# Altium project APD_part.PrjPcb
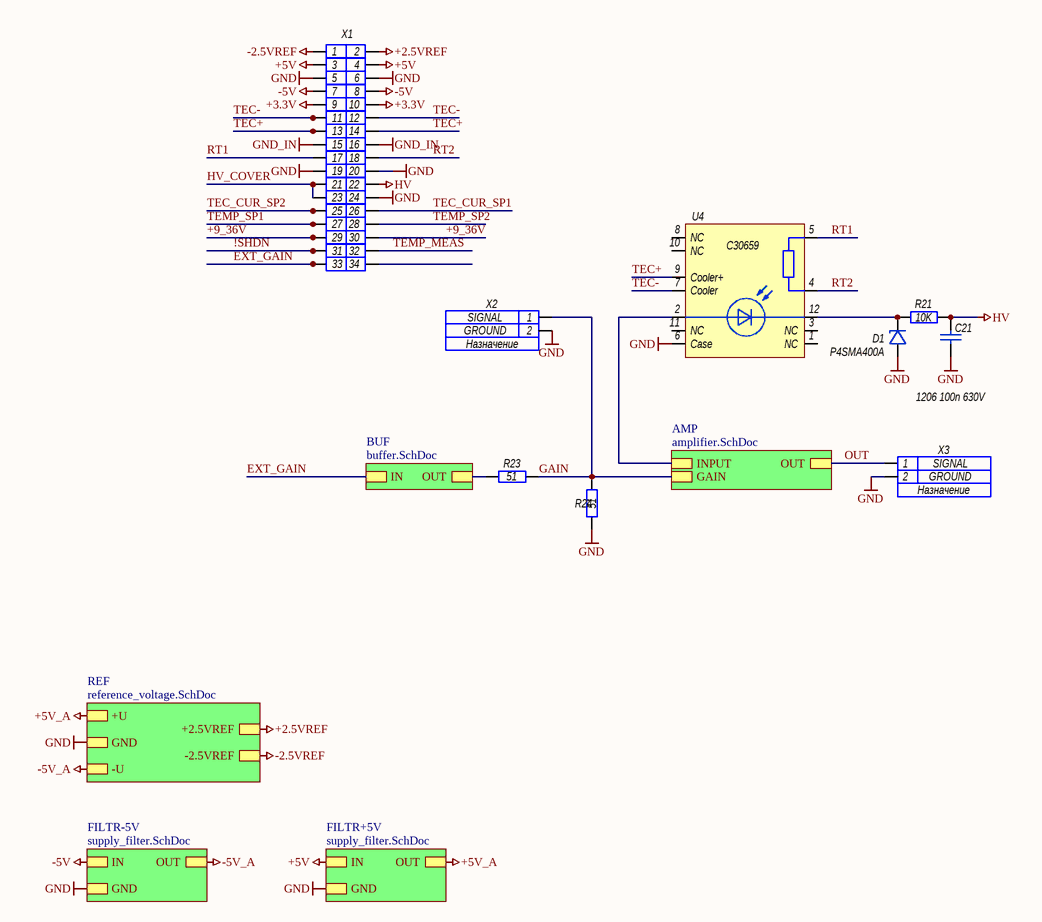
[diagram p0: main.SchDoc]
5 sheets, 76 parts. Net scope: hierarchical (ports join the sheet entries above them; power ports are global).
Board file: APD_part.PcbDoc
Sheets:
  main.SchDoc
    REF = reference_voltage.SchDoc
    FILTR+5V = supply_filter.SchDoc
    FILTR-5V = supply_filter.SchDoc
    AMP = amplifier.SchDoc
    BUF = buffer.SchDoc

## Sheet main.SchDoc
size A4; SheetNumber: 1; SheetTotal: 6

### Parts
C21  1206 100n 630V  [CAP_2220]
D1  P4SMA400A  [SOD-123]
R21  10K  [RES_0805]
R23  51  [RES_0603]
R24  51  [RES_0603]
U4  C30659  [C30659]
X1  ?  [BH-34]  (value not drawn)
X2  Net1: SIGNAL  Net2: GROUND  Name: Назначение  [SMA_V]  (hidden comment: Model)
X3  Net1: SIGNAL  Net2: GROUND  Name: Назначение  [SMA_V]  (hidden comment: Model)

### Sub-sheets
AMP = amplifier.SchDoc: GAIN, INPUT, OUT
BUF = buffer.SchDoc: IN, OUT
FILTR+5V = supply_filter.SchDoc: IN, OUT, GND
FILTR-5V = supply_filter.SchDoc: IN, OUT, GND
REF = reference_voltage.SchDoc: GND, -U, -2.5VREF, +2.5VREF, +U

### Nets
+2.5VREF: X1.2 ; sheet REF/+2.5VREF
+3.3V: X1.9 X1.10
+5V: X1.3 X1.4 ; sheet FILTR+5V/IN
+5V_A: sheet REF/+U, sheet FILTR+5V/OUT
-2.5VREF: X1.1 ; sheet REF/-2.5VREF
-5V: X1.7 X1.8 ; sheet FILTR-5V/IN
-5V_A: sheet REF/-U, sheet FILTR-5V/OUT
GND: C21.2 D1.1 R24.1 U4.6(Case) X1.5 X1.6 X1.19 X1.20 X1.24 X2.G(2) X3.G(2) ; sheet REF/GND, sheet FILTR+5V/GND, sheet FILTR-5V/GND
GND_IN: X1.15 X1.16
HV: C21.1 R21.2 X1.22
!SHDN: X1.31
+9_36V: X1.29 X1.30
EXT_GAIN: X1.33 ; sheet BUF/IN
GAIN: R23.2 R24.2 X2.S(1) ; sheet AMP/GAIN
HV_COVER: X1.21 X1.23
OUT: X3.S(1) ; sheet AMP/OUT
RT1: U4.5 X1.17
RT2: U4.4 X1.18
TEC+: U4.9(Cooler+) X1.13 X1.14
TEC-: U4.7(Cooler) X1.11 X1.12
TEC_CUR_SP1: X1.26
TEC_CUR_SP2: X1.25
TEMP_MEAS: X1.32
TEMP_SP1: X1.27
TEMP_SP2: X1.28
NetC4_1: U4.2 ; sheet AMP/INPUT
NetD1_2: D1.2 R21.1 U4.12
NetR23_1: R23.1 ; sheet BUF/OUT

Not connected (* = marked no-connect by the designer): U4 1(NC) 3(NC) 8(NC) 10(NC) 11(NC); X1 34

### Library data of the parts
C21 = Capacitor: Конденсатор
D1 = SMFxxA: Диод защитный; ValueBOM: -; ValueSCH: -; MarkPCB: -; HelpURL: C:\Datasheets\SMF.pdf
R21 = Resisitor: Резистор; ValueBOM: 0805 10k 0.125; MarkPCB: 103; ValueSCH: 10k
R23 R24 = Resisitor: Резистор; ValueBOM: 0805 10k 0.125; ValueSCH: 10k; MarkPCB: 103
U4 = C30659: Модуль с ЛФД; ValueBOM: C30659; ValueSCH: C30659; MarkPCB: C30659; HelpURL: C:\Datasheets\C30659.pdf
X1 = Connector 17x2: ValueSCH: Model
X2 X3 = Connector 2: ValueSCH: Model

## Sheet reference_voltage.SchDoc
size A3; SheetNumber: 3; SheetTotal: 5
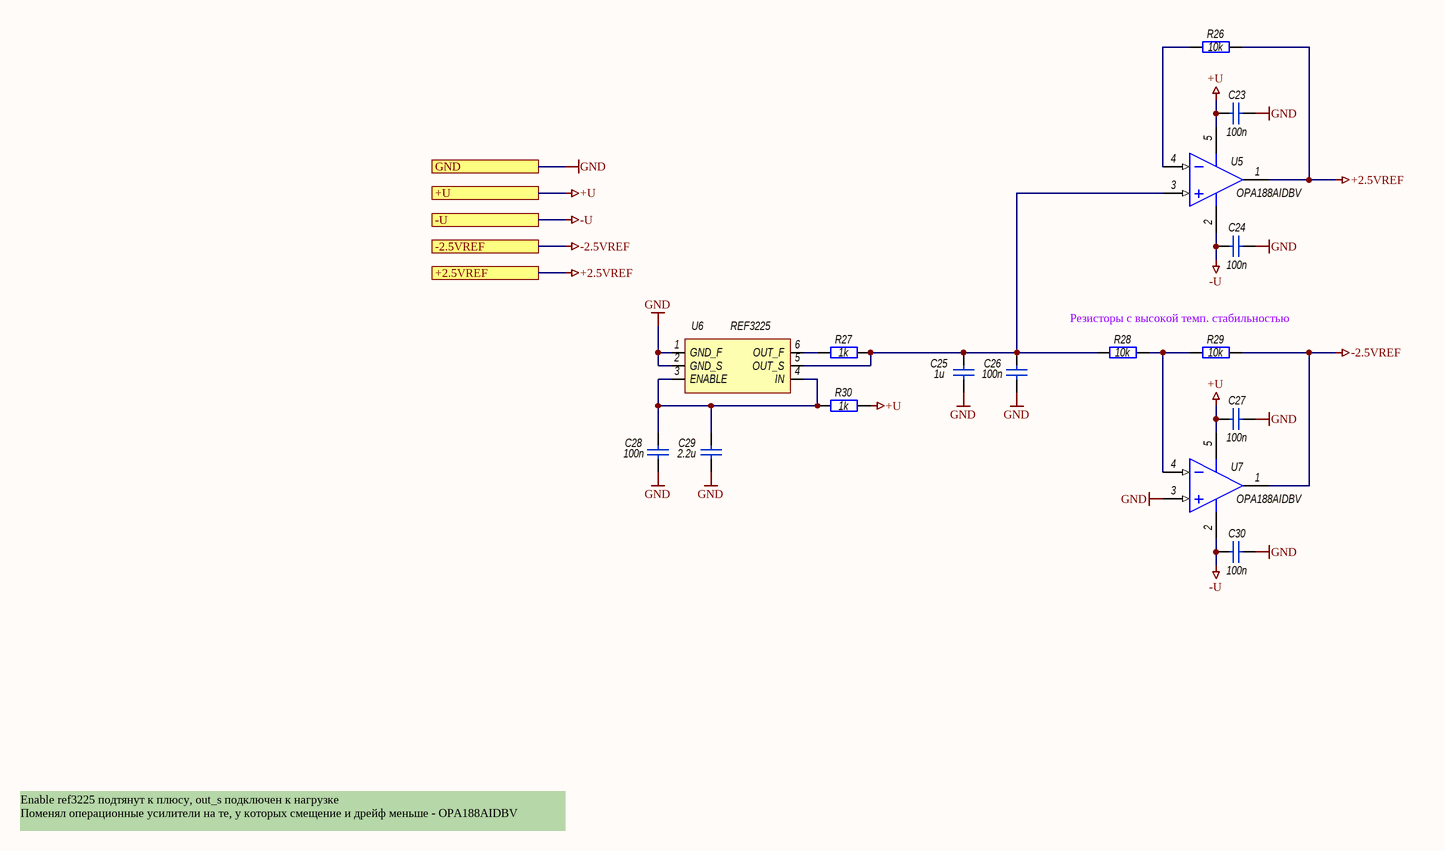
[diagram p1: reference_voltage.SchDoc]

### Parts
C23  100n  [CAP_0603]
C24  100n  [CAP_0603]
C25  1u  [CAP_0603]
C26  100n  [CAP_0603]
C27  100n  [CAP_0603]
C28  100n  [CAP_0603]
C29  2.2u  [CAP_0603]
C30  100n  [CAP_0603]
R26  10k  [RES_0603]
R27  1k  [RES_0603]
R28  10k  [RES_0603]
R29  10k  [RES_0603]
R30  1k  [RES_0603]
U5  OPA188AIDBV  [sot235]
U6  REF3225  [SOT236]
U7  OPA188AIDBV  [sot235]

### Ports
+2.5VREF, +U, -2.5VREF, -U, GND

### Nets
+2.5VREF: R26.2 U5.1(OUT) ; port +2.5VREF
+U: C23.1 C27.1 R30.2 U5.5(V+) U7.5(V+) ; port +U  [project net +5V_A]
-2.5VREF: R29.2 U7.1(OUT) ; port -2.5VREF
-U: C24.1 C30.1 U5.2(V-) U7.2(V-) ; port -U  [project net -5V_A]
GND: C23.2 C24.2 C25.1 C26.1 C27.2 C28.1 C29.1 C30.2 U6.1(GND_F) U6.2(GND_S) U7.3(IN+) ; port GND
NetC25_2: C25.2 C26.2 R27.2 R28.1 U5.3(IN+) U6.5(OUT_S)
NetC28_2: C28.2 C29.2 R30.1 U6.3(ENABLE) U6.4(IN)
NetR26_1: R26.1 U5.4(IN-)
NetR27_1: R27.1 U6.6(OUT_F)
NetR28_2: R28.2 R29.1 U7.4(IN-)

### Notes on the sheet
- Резисторы с высокой темп. стабильностью
- Enable ref3225 подтянут к плюсу, out_s подключен к нагрузке
  Поменял операционные усилители на те, у которых смещение и дрейф меньше - OPA188AIDBV

### Library data of the parts
C23-C30 = Capacitor: Конденсатор
R26 R28 R29 = Resisitor: as R21 on sheet main; ValueSCH: 10k
R27 R30 = Resisitor: Резистор
U5 U7 = OPAMP SOT235: Операционный усилитель
U6 = REF32xx: Источник опорного напряжения; ValueBOM: REF32xx; ValueSCH: REF32xx; HelpURL: C:\Datasheets\REF32xx.pdf

## Sheet supply_filter.SchDoc
size A4; SheetNumber: 4; SheetTotal: 5
Used 2 times, as channels FILTR+5V, FILTR-5V. Parts and nets are listed once, with the designators drawn on the sheet.
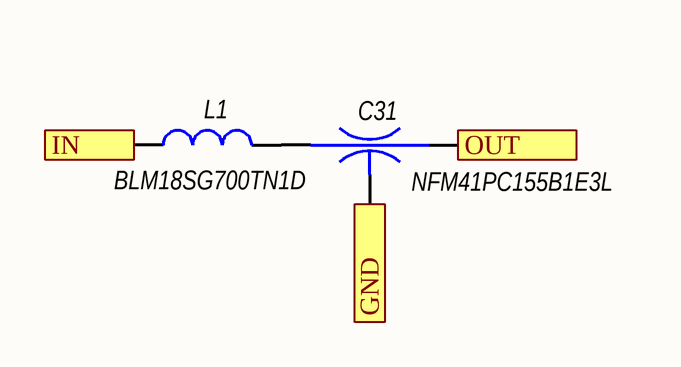
[diagram p2: supply_filter.SchDoc]

### Parts
C31  NFM41PC155B1E3L  [FIL_NFM41PC155B1E3L]
L1  BLM18SG700TN1D  [RES_0603]

### Ports
GND, IN, OUT

### Nets
GND: C31.2 ; port GND
IN: L1.2 ; port IN
OUT: C31.3 ; port OUT
NetC31_1: C31.1 L1.1

### Channels
FILTR+5V: designators end in _FILTR+5V; ports GND=GND IN=+5V OUT=+5V_A
FILTR-5V: designators end in _FILTR-5V; ports GND=GND IN=-5V OUT=-5V_A

### Library data of the parts
C31 = Capacity_filtr: Емкостной фильтр проходной
L1 = FERRITE_BEAD: Дроссель ЭМП; ValueBOM: SDR0403-101k; ValueSCH: 100u; MarkPCB: 101; HelpURL: C:\Datasheets\SRD0403.pdf

## Sheet amplifier.SchDoc
size A4; SheetNumber: 2; SheetTotal: 5
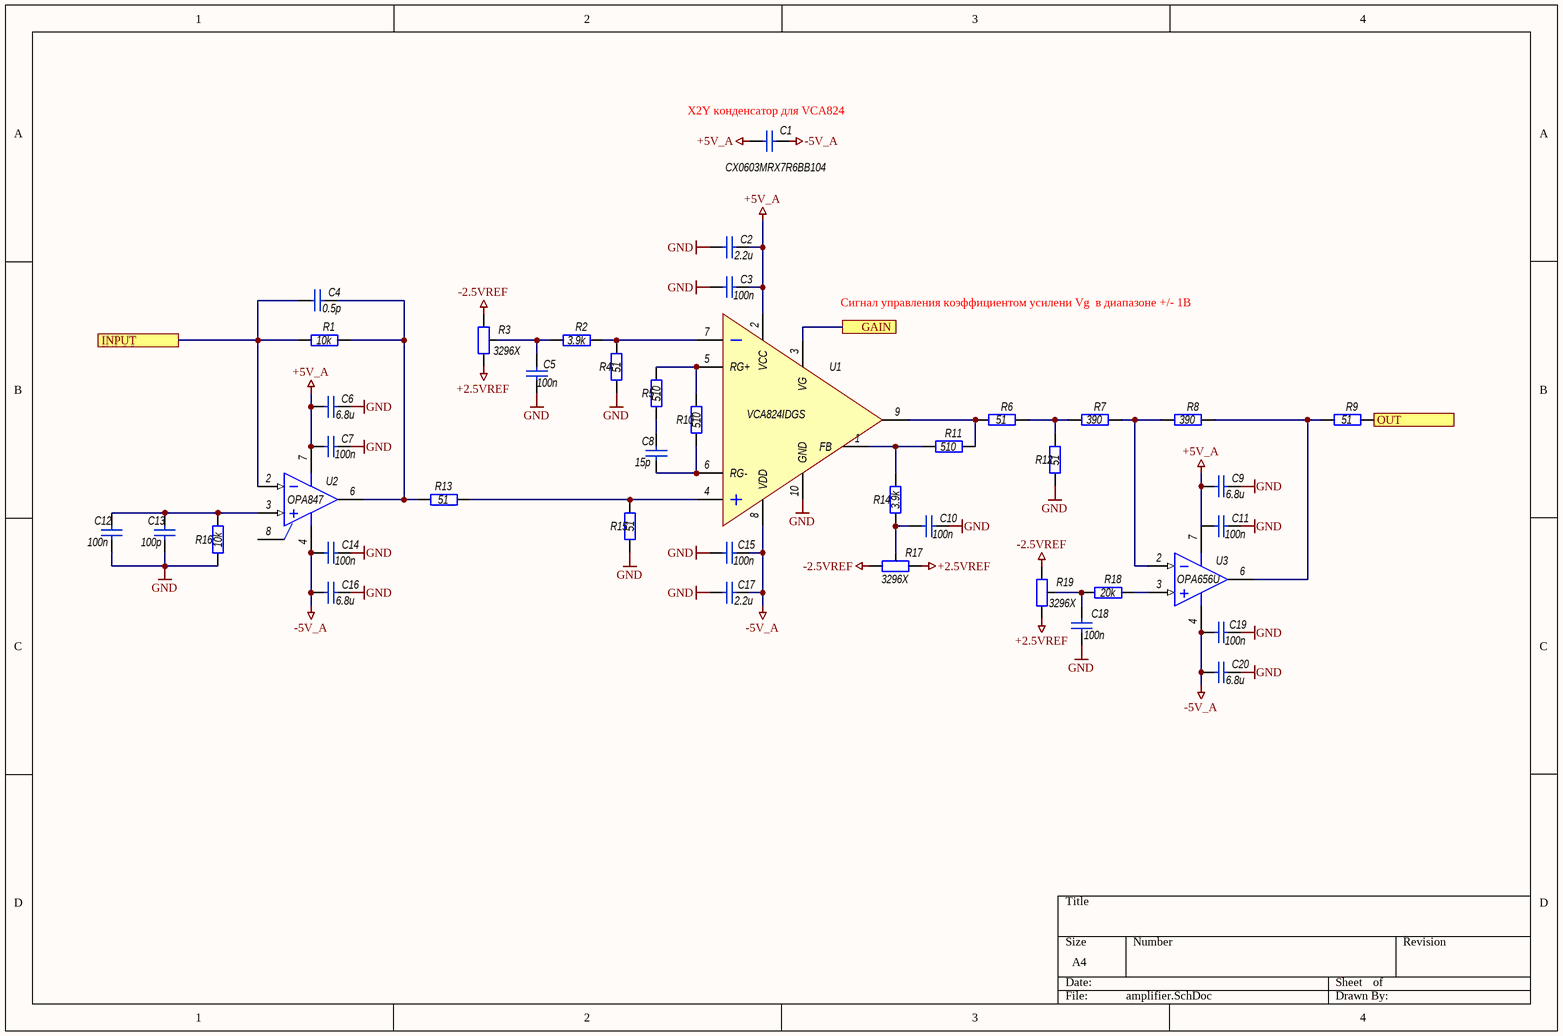
[diagram p3: amplifier.SchDoc]

### Parts
C1  CX0603MRX7R6BB104  [CAP_0603]
C2  2.2u  [CAP_0805]
C3  100n  [CAP_0603]
C4  0.5p  [CAP_0603]
C5  100n  [CAP_0603]
C6  6.8u  [CAP_0805]
C7  100n  [CAP_0603]
C8  15p  [CAP_0603]
C9  6.8u  [CAP_0805]
C10  100n  [CAP_0603]
C11  100n  [CAP_0603]
C12  100n  [CAP_0603]
C13  100p  [CAP_0603]
C14  100n  [CAP_0603]
C15  100n  [CAP_0603]
C16  6.8u  [CAP_0805]
C17  2.2u  [CAP_0805]
C18  100n  [CAP_0603]
C19  100n  [CAP_0603]
C20  6.8u  [CAP_0805]
R1  10k  [RES_0603]
R2  3.9k  [RES_0603]
R3  3296X  [3296X]
R4  51  [RES_0603]
R5  510  [RES_0603]
R6  51  [RES_0805]
R7  390  [RES_0603]
R8  390  [RES_0603]
R9  51  [RES_0805]
R10  510  [RES_0603]
R11  510  [RES_0603]
R12  51  [RES_0805]
R13  51  [RES_0805]
R14  3.9k  [RES_0603]
R15  51  [RES_0805]
R16  10k  [RES_0603]
R17  3296X  [3296X]
R18  20k  [RES_0603]
R19  3296X  [3296X]
U1  VCA824IDGS  [VSSOP10]
U2  OPA847  [SO8-150]
U3  OPA656U  [SO8-150]

### Ports
GAIN, INPUT, OUT

### Nets
+2.5VREF: R3.1 R17.1 R19.1
+5V_A: C1.1 C2.2 C3.2 C6.1 C7.1 C9.1 C11.1 U1.2(VCC) U2.7(V+) U3.7(V+)
-2.5VREF: R3.3 R17.3 R19.3
-5V_A: C1.2 C14.1 C15.2 C16.1 C17.2 C19.1 C20.1 U1.8(VDD) U2.4(V-) U3.4(V-)
GND: C2.1 C3.1 C5.2 C6.2 C7.2 C9.2 C10.2 C11.2 C12.1 C13.1 C14.2 C15.1 C16.2 C17.1 C18.2 C19.2 C20.2 R4.1 R12.1 R15.1 R16.1 U1.10(GND)
GAIN: U1.3(VG) ; port GAIN
OUT: R9.2 ; port OUT
NetC4_1: C4.1 R1.1 U2.2(IN-) ; port INPUT
NetC4_2: C4.2 R1.2 R13.1 U2.6(OUT)
NetC5_1: C5.1 R2.1 R3.2
NetC8_1: C8.1 R10.1 U1.6(RG-)
NetC8_2: C8.2 R5.1
NetC10_1: C10.1 R14.1 R17.2
NetC12_2: C12.2 C13.2 R16.2 U2.3(IN+)
NetC18_1: C18.1 R18.1 R19.2
NetR2_2: R2.2 R4.2 U1.7(RG)
NetR5_2: R5.2 R10.2 U1.5(RG+)
NetR6_1: R6.1 R11.2 U1.9(FB)
NetR6_2: R6.2 R7.1 R12.2
NetR7_2: R7.2 R8.1 U3.2(IN-)
NetR8_2: R8.2 R9.1 U3.6(OUT)
NetR11_1: R11.1 R14.2 U1.1(FB)
NetR13_2: R13.2 R15.2 U1.4(RG)
NetR18_2: R18.2 U3.3(IN+)

Not connected (* = marked no-connect by the designer): U2 8(RG)

### Notes on the sheet
- (near C1) X2Y конденсатор для VCA824
- (near U1) Сигнал управления коэффициентом усилени Vg  в диапазоне +/- 1В

### Library data of the parts
C1-C20 = Capacitor: Конденсатор
R1 R16 = Resisitor: as R21 on sheet main; ValueSCH: 10k
R2 R4-R15 R18 = Resisitor: as R23 on sheet main
R3 R17 R19 = 3296X: Резистор подстроечный; ValueBOM: 3296X; ValueSCH: 3296X; HelpURL: C:\Datasheets\.pdf
U1 = VCA824 (VSOP10)
U2 = OPA847: Операционный усилитель; ValueBOM: OPA847; ValueSCH: OPA847; MarkPCB: OPA847; HelpURL: C:\Datasheets\OPA847.pdf
U3 = OPA657: Операционный усилитель; ValueBOM: OPA657; ValueSCH: OPA657; MarkPCB: OPA657; HelpURL: C:\Datasheets\OPA657.pdf

## Sheet buffer.SchDoc
size A4; SheetNumber: 5; SheetTotal: 5
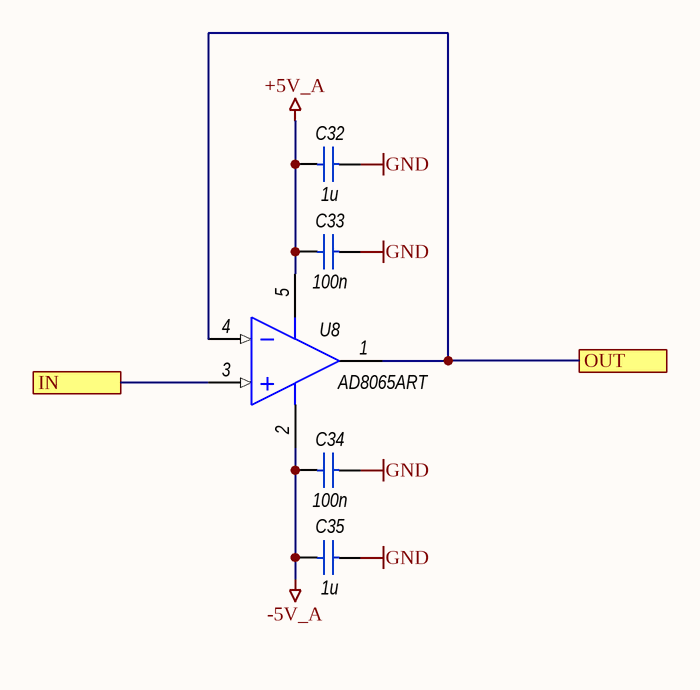
[diagram p4: buffer.SchDoc]

### Parts
C32  1u  [CAP_0603]
C33  100n  [CAP_0603]
C34  100n  [CAP_0603]
C35  1u  [CAP_0603]
U8  AD8065ART  [sot235]

### Ports
IN, OUT

### Nets
+5V_A: C32.1 C33.1 U8.5(V+)
-5V_A: C34.1 C35.1 U8.2(V-)
GND: C32.2 C33.2 C34.2 C35.2
EXT_GAIN: U8.3(IN+) ; port IN
NetR23_1: U8.1(OUT) U8.4(IN-) ; port OUT

### Library data of the parts
C32-C35 = Capacitor: Конденсатор
U8 = OPAMP SOT235: Операционный усилитель

## Nets that join several sheets
+2.5VREF: main (X1.2), reference_voltage (R26.2 U5.1), amplifier (R3.1 R17.1 R19.1)
+5V: main (X1.3 X1.4), FILTR+5V (L1_FILTR+5V.2)
+5V_A: reference_voltage (5 pins), FILTR+5V (C31_FILTR+5V.3), amplifier (10 pins), buffer (C32.1 C33.1 U8.5)
-2.5VREF: main (X1.1), reference_voltage (R29.2 U7.1), amplifier (R3.3 R17.3 R19.3)
-5V: main (X1.7 X1.8), FILTR-5V (L1_FILTR-5V.2)
-5V_A: reference_voltage (C24.1 C30.1 U5.2 U7.2), FILTR-5V (C31_FILTR-5V.3), amplifier (10 pins), buffer (C34.1 C35.1 U8.2)
GND: main (11 pins), reference_voltage (11 pins), FILTR+5V (C31_FILTR+5V.2), FILTR-5V (C31_FILTR-5V.2), amplifier (22 pins), buffer (C32.2 C33.2 C34.2 C35.2)
EXT_GAIN: main (X1.33), buffer (U8.3)
GAIN: main (R23.2 R24.2 X2.S), amplifier (U1.3)
NetC4_1: main (U4.2), amplifier (C4.1 R1.1 U2.2)
NetR23_1: main (R23.1), buffer (U8.1 U8.4)
OUT: main (X3.S), amplifier (R9.2)